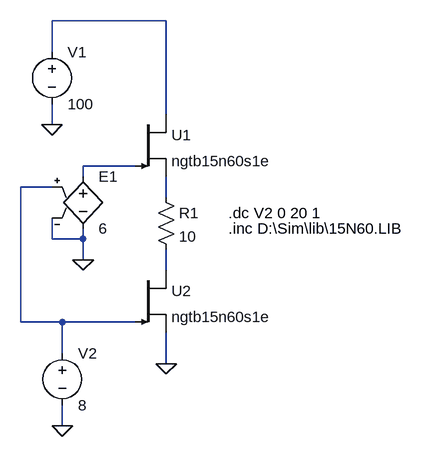
[diagram p0: schematic meia ponte h.asc]
meia ponte h.asc, the LTspice schematic file:
Version 4
SHEET 1 880 724
WIRE 272 -48 96 -48
WIRE 96 0 96 -48
WIRE 272 96 272 -48
WIRE 96 112 96 80
WIRE 224 176 144 176
WIRE 144 192 144 176
WIRE 96 208 48 208
WIRE 272 224 272 192
WIRE 96 288 96 256
WIRE 144 288 144 272
WIRE 144 288 96 288
WIRE 144 320 144 288
WIRE 272 336 272 304
WIRE 48 416 48 208
WIRE 112 416 48 416
WIRE 224 416 112 416
WIRE 112 464 112 416
WIRE 272 480 272 432
WIRE 112 576 112 544
FLAG 96 112 0
FLAG 112 576 0
FLAG 144 320 0
FLAG 272 480 0
SYMBOL res 256 208 R0
SYMATTR InstName R1
SYMATTR Value 10
SYMATTR SpiceLine tol=5 pwr=3k
SYMBOL voltage 96 -16 R0
WINDOW 123 0 0 Left 2
WINDOW 39 0 0 Left 2
SYMATTR InstName V1
SYMATTR Value 100
SYMBOL voltage 112 448 R0
WINDOW 123 0 0 Left 2
WINDOW 39 0 0 Left 2
SYMATTR InstName V2
SYMATTR Value 8
SYMBOL Misc\\nigbt 224 96 R0
SYMATTR InstName U1
SYMATTR Value ngtb15n60s1e
SYMBOL Misc\\nigbt 224 336 R0
SYMATTR InstName U2
SYMATTR Value ngtb15n60s1e
SYMBOL e 144 176 R0
SYMATTR InstName E1
SYMATTR Value 6
TEXT 368 248 Left 2 !.dc V2 0 20 1
TEXT 368 272 Left 2 !.inc D:\\Sim\\lib\\15N60.LIB

The netlist it stands for:
* meia ponte h.asc
R1 N004 N005 10 tol=5 pwr=3k
V1 N001 0 100
V2 N003 0 8
Z§U1 N001 N002 N004 ngtb15n60s1e
Z§U2 N005 N003 0 ngtb15n60s1e
E1 N002 0 N003 0 6
.dc V2 0 20 1
.inc D:\Sim\lib\15N60.LIB
.backanno
.end